# EasyEDA Pro project repeater.eprj

# Schematic Schematic1
Board Name: Board1; Create Date: 2026-04-16; Page Name: P1; Project Name: repeater; Schematic Name: Schematic1; Update Date: 2026-06-14; Company: EasyEDA.com; Page Size: A4; Version: V1.0
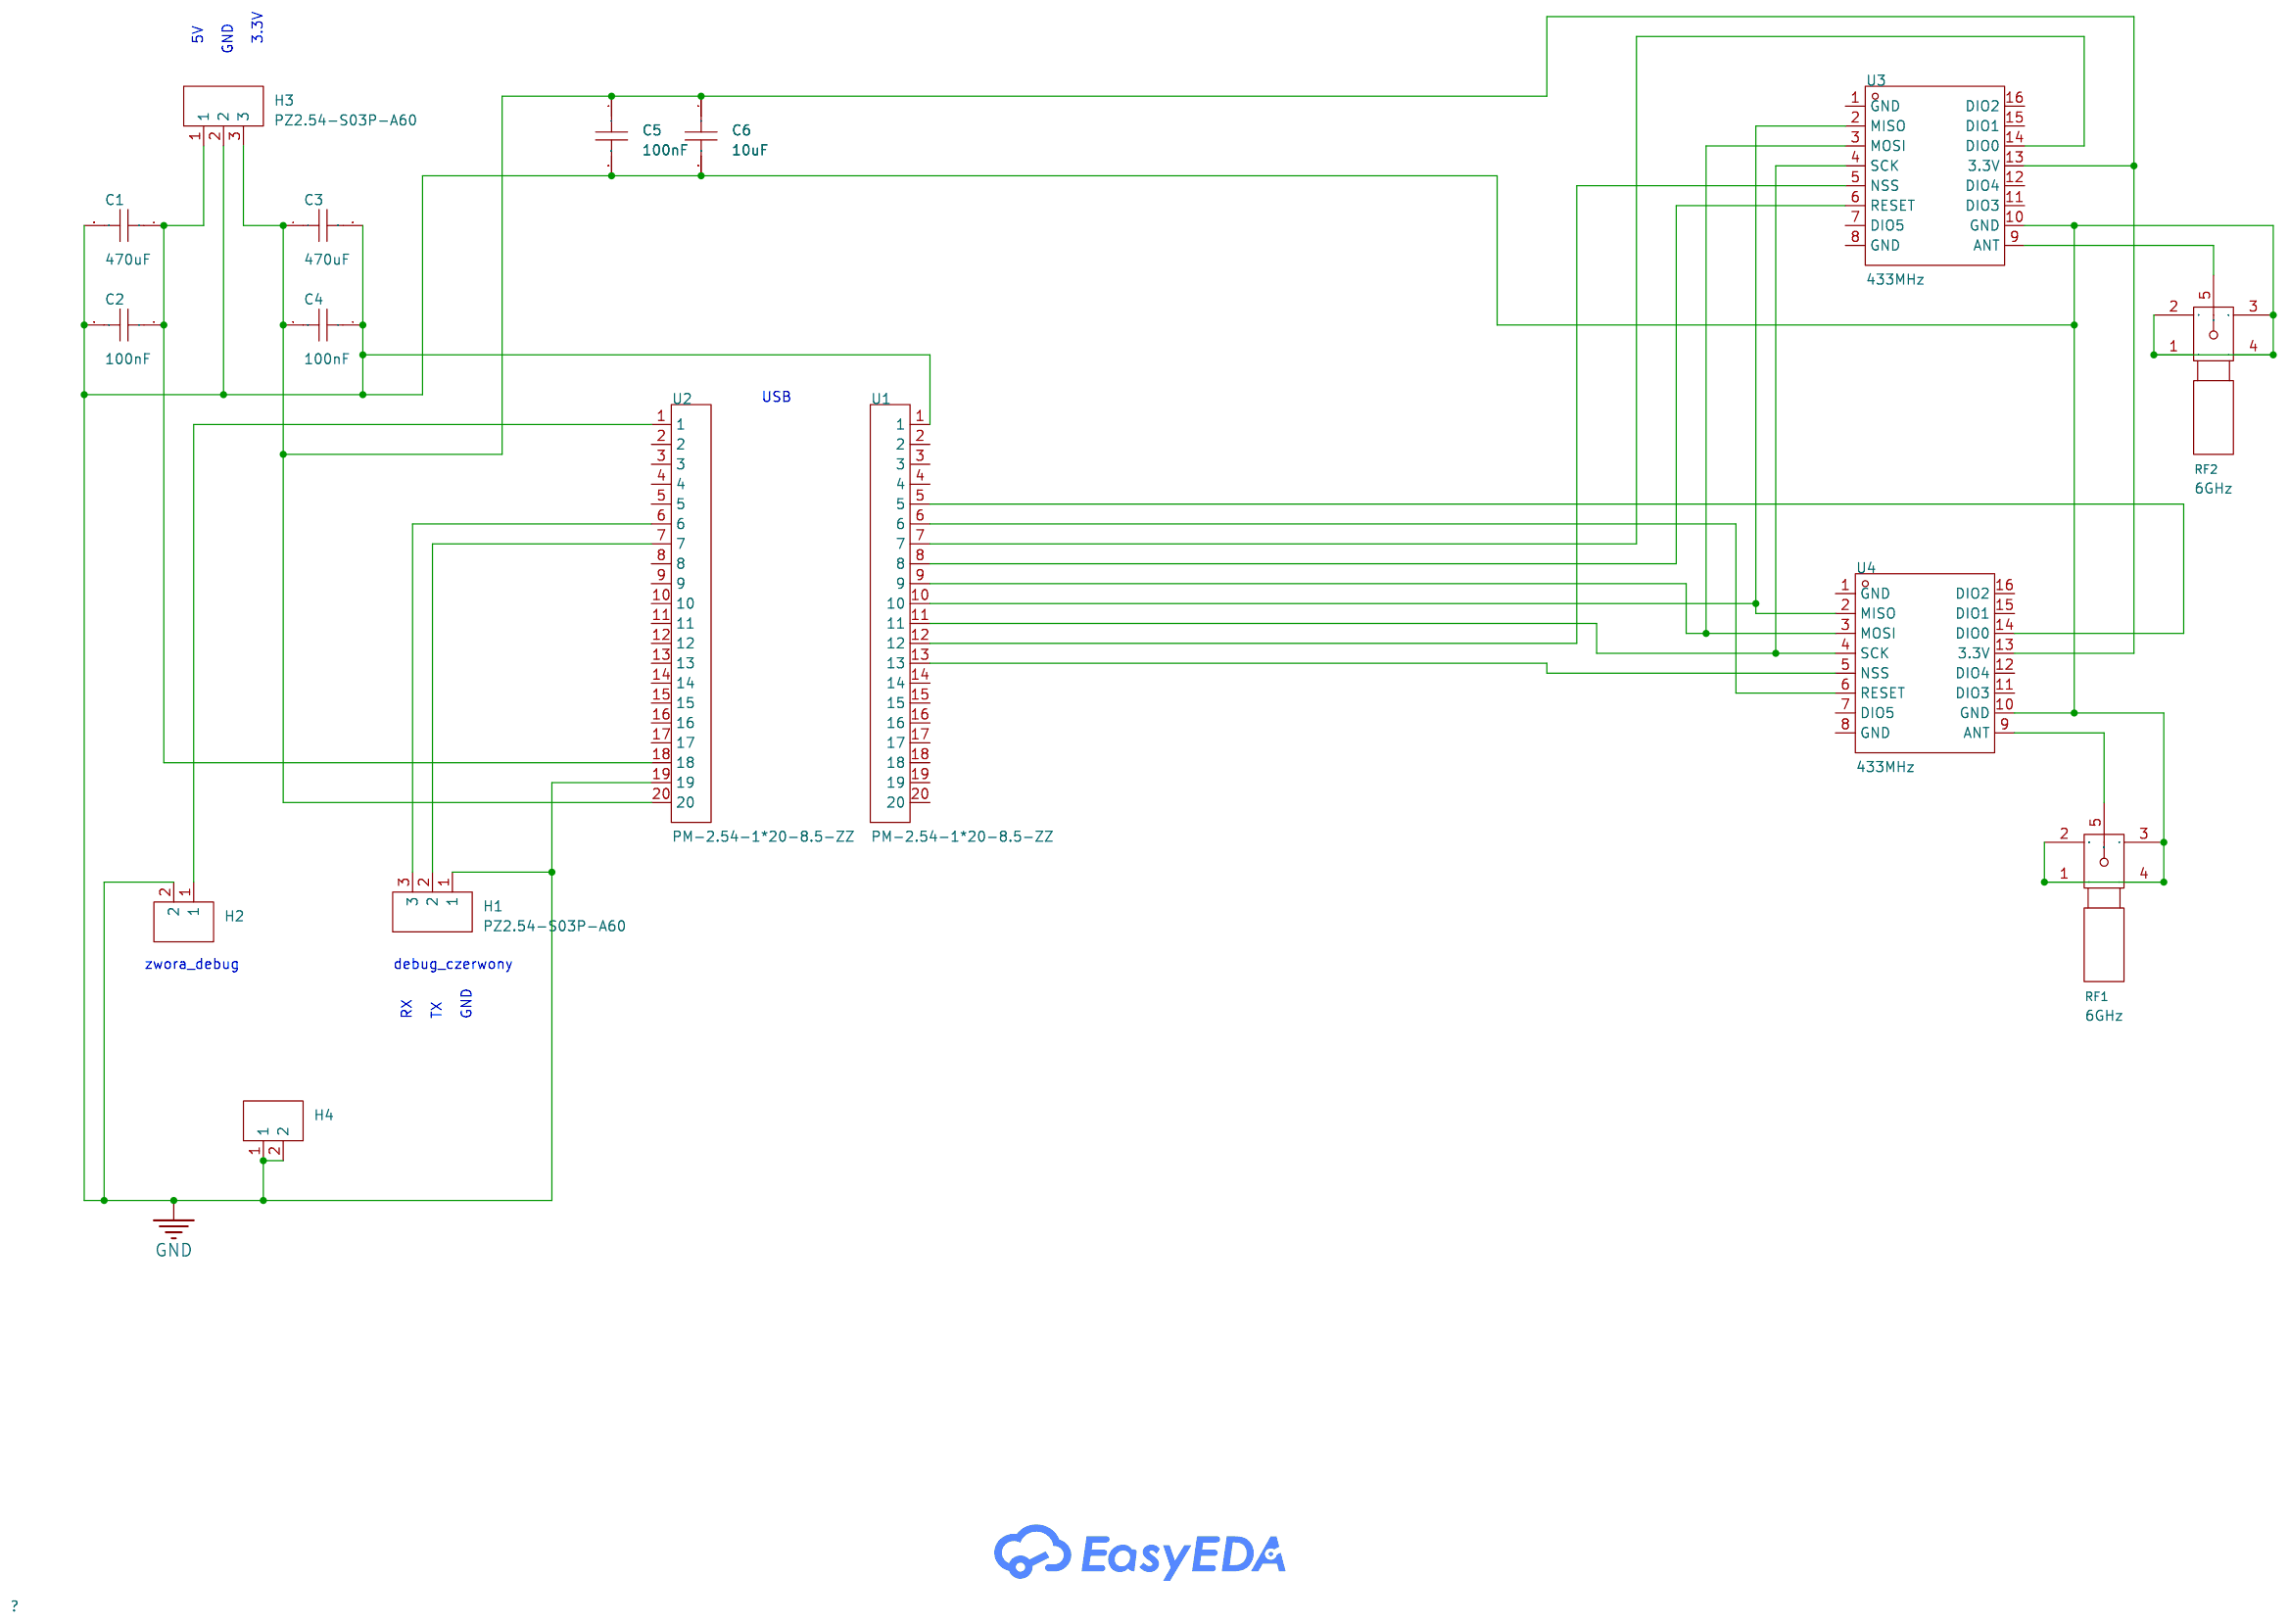
[diagram p0: schematic sheet]

## Parts
C1  470uF  [CAP-TH_BD10.0-P5.00-D0.6-FD]
C2  100nF  [C0603]
C3  470uF  [CAP-TH_BD10.0-P5.00-D0.6-FD]
C4  100nF  [C0603]
C5  100nF  [C0603]
C6  10uF  [C0603]
H1  PZ2.54-S03P-A60  [HDR-TH_3P-P2.54-V-M-B]
H2  PZ2.54-0102P-H25  [HDR-TH_2P-P2.54-V-M_2]
H3  PZ2.54-S03P-A60  [HDR-TH_3P-P2.54-V-M-B]
H4  PZ2.54-0102P-H25  [HDR-TH_2P-P2.54-V-M_2]
RF1  6GHz  [SMA-TH_BWSMA-KE-Z001]
RF2  6GHz  [SMA-TH_BWSMA-KE-Z001]
U1  PM-2.54-1*20-8.5-ZZ  [HDR-TH_20P-P2.54-V-F-2]
U2  PM-2.54-1*20-8.5-ZZ  [HDR-TH_20P-P2.54-V-F-2]
U3  433MHz  [COMM-SMD_RFM95W]
U4  433MHz  [COMM-SMD_RFM95W]

## Library data of the parts
C1 C3 = 470UF25VG130GF: LCSC Part Name: 470uF ±20% 25V; Supplier Part: C46867093; Manufacturer: Econd(米朗电子); Supplier Footprint: 插件,D10xL13mm; Datasheet: https://item.szlcsc.com/datasheet/470UF25VG130GF/49031958.html; Supplier: LCSC; Tolerance: ±20%; Voltage Rating: 25V; Ripple Current: 865mA@100KHz; Equivalent Series Resistance(ESR): 76mΩ; Pin Spacing: 5mm; Diameter: 10mm; Height - Seated (Max): 13mm; Lifetime: 3000hrs@105℃; Operating Temperature: -40℃~+105℃
C2 C4 C5 = CC0603KRX7R9BB104: Capacitance:100nF Tolerance:±10% Tolerance:±10% Voltage Rating:50V Temperature Coefficient:X7R; LCSC Part Name: 100nF ±10% 50V; Supplier Part: C14663; Manufacturer: YAGEO(国巨); Supplier Footprint: 0603; JLCPCB Part Class: Basic Part; Datasheet: https://item.szlcsc.com/datasheet/CC0603KRX7R9BB104/15331.html; Supplier: LCSC; Tolerance: ±10%; Voltage Rating: 50V; Temperature Coefficient: X7R
C6 = CL10A106KP8NNNC: Capacitance:10uF Tolerance:±10% Tolerance:±10% Voltage Rating:10V Temperature Coefficient:X5R; LCSC Part Name: 10uF ±10% 10V; Supplier Part: C19702; Manufacturer: SAMSUNG(三星); Supplier Footprint: 0603; JLCPCB Part Class: Basic Part; Datasheet: https://item.szlcsc.com/datasheet/CL10A106KP8NNNC/20411.html; Supplier: LCSC; Tolerance: ±10%; Voltage Rating: 10V; Temperature Coefficient: X5R
H1 H3 = PZ2.54-S03P-A60: LCSC Part Name: 1x3P 间距:2.54mm 方针 直插; Supplier Part: C42431831; Manufacturer: JXTCONN(聚兴泰); Supplier Footprint: 插件,P=2.54mm; JLCPCB Part Class: Extended Part; Datasheet: https://item.szlcsc.com/datasheet/PZ2.54-S03P-A60/44458961.html; Supplier: LCSC; Pin Structure: 1x3P; Pitch: 2.54mm; Circluar Pins/Square Pins: Pin Header; Mounting Type: Through Hole; Number of Rows: 1; Number of Pins: 3P; Current Rating: 3A; Length of Mating Pin: 6mm; Insulation Height: 2.5mm; Length of End Connection Pin: 3mm; Contact Material: Brass; Contact Plating: Gold; Operating Temperature: -40℃~+105℃; Color: Black
H2 H4 = PZ2.54-0102P-H25: LCSC Part Name: 1x2P 间距:2.54mm 方针 直插; Supplier Part: C42431819; Manufacturer: JXTCONN(聚兴泰); Supplier Footprint: 插件,P=2.54mm; JLCPCB Part Class: Extended Part; Datasheet: https://item.szlcsc.com/datasheet/PZ2.54-0102P-H25/44458949.html; Supplier: LCSC; Pin Structure: 1x2P; Pitch: 2.54mm; Circluar Pins/Square Pins: Pin Header; Mounting Type: Through Hole; Number of Rows: 1; Number of Pins: 2P; Current Rating: 3A; Length of Mating Pin: 6mm; Insulation Height: 2.5mm; Length of End Connection Pin: 3mm; Contact Material: Brass; Contact Plating: Gold; Operating Temperature: -40℃~+105℃; Color: Black
RF1 RF2 = BWSMA-KE-Z001_C496549: LCSC Part Name: 内孔 SMA 正脚; Supplier Part: C496549; Manufacturer: BAT WIRELESS(蝙蝠无线); Manufacturer Part: BWSMA-KE-Z001; Supplier Footprint: 插件; JLCPCB Part Class: Extended Part; Datasheet: https://item.szlcsc.com/datasheet/BWSMA-KE-Z001/508498.html; Supplier: LCSC; Connector Type: Board Side; Interface: Inner Bore; Number of Ports: 1; Interface Diameter: 6.2mm; RF Series: SMA; Impedance: 50Ω; Style: Positive Pin; Operating Temperature Range: -65℃~+165℃
U1 U2 = PM-2.54-1*20-8.5-ZZ: LCSC Part Name: 1x20P 间距:2.54mm 直插; Supplier Part: C53207428; Manufacturer: BXCONN(宝讯); Supplier Footprint: 插件,P=2.54mm; JLCPCB Part Class: Extended Part; Datasheet: https://item.szlcsc.com/datasheet/PM-2.54-1*20-8.5-ZZ/56243332.html; Supplier: LCSC; Holes Structure: 1x20P; Pitch: 2.54mm; Circular Hole / Square Hole: Square Hole; Mounting Type: Through Hole; Number of Rows: 1; Number of Positions: 20P; Current Rating: 3A; Holes Direction: Top; Insulation Height: 8.5mm; Contact Material: Brass; Contact Plating: Gold; Operating Temperature: -40℃~+105℃; PIN Length: 3.2mm
U3 U4 = DL-RFM96-433M: Frequency:433MHz Output Power:-1dBm~95dBm Output Power:-1dBm~95dBm Support Interface:SPI Modulation System:LoRa；MSK；GFSK；FSK；GMSK Operating Voltage:3.3V Operating Voltage:3.3V Antenna Type:- Receive  Current:10.8mA Send  Current:120mA Sensitivity:-148dBm; LCSC Part Name: lora模块 sx1276 433M无射频线模块 接收发射一体loraWAN超远距离; Supplier Part: C2844474; Manufacturer: DreamLNK(骏晔科技); Supplier Footprint: SMD,16x16mm; JLCPCB Part Class: Extended Part; Datasheet: https://atta.szlcsc.com/upload/public/pdf/source/20240412/4C032EDBEA51F5778F500F593BDA4CE8.pdf; Supplier: LCSC; Output Power: -1dBm~95dBm; Support Interface: SPI; Modulation System: LoRa；MSK；GFSK；FSK；GMSK; Operating Voltage: 3.3V; Receive  Current: 10.8mA; Send  Current: 120mA; Sensitivity: -148dBm; Operating Temperature: -20℃~+70℃

## Nets
GND: C1.2 C2.2 C3.2 C4.1 C5.2 C6.2 H1.1 H2.2 H3.2 H4.1 H4.2 RF1.1 RF1.2 RF1.3 RF1.4 RF2.1 RF2.2 RF2.3 RF2.4 U1.1 U2.19 U3.10(GND) U4.10(GND)
$1N962: H2.1 U2.1
$1N975: H1.3 U2.6
$1N980: H1.2 U2.7
$1N1152: C1.1 C2.1 H3.1 U2.18
$1N1262: C3.1 C4.2 C5.1 C6.1 H3.3 U2.20 U3.13(3.3V) U4.13(3.3V)
$1N1434: U1.5 U4.14(DIO0)
$1N1440: U1.6 U4.6(RESET)
$1N1447: U1.7 U3.14(DIO0)
$1N1459: U1.8 U3.6(RESET)
$1N1469: U1.9 U3.3(MOSI) U4.3(MOSI)
$1N1489: U1.10 U3.2(MISO) U4.2(MISO)
$1N1508: U1.11 U3.4(SCK) U4.4(SCK)
$1N1528: U1.12 U3.5(NSS)
$1N1535: U1.13 U4.5(NSS)
$1N1993: RF2.5 U3.9(ANT)
$1N1998: RF1.5 U4.9(ANT)

Not connected (* = marked no-connect by the designer): U1 2 3 4 14 15 16 17 18 19 20; U2 2 3 4 5 8 9 10 11 12 13 14 15 16 17; U3 1(GND) 7(DIO5) 8(GND) 11(DIO3) 12(DIO4) 15(DIO1) 16(DIO2); U4 1(GND) 7(DIO5) 8(GND) 11(DIO3) 12(DIO4) 15(DIO1) 16(DIO2)

## Notes on the sheet
- 5V
- 3.3V
- GND
- USB
- zwora_debug
- debug_czerwony
- RX
- TX
- GND

# Board PCB1
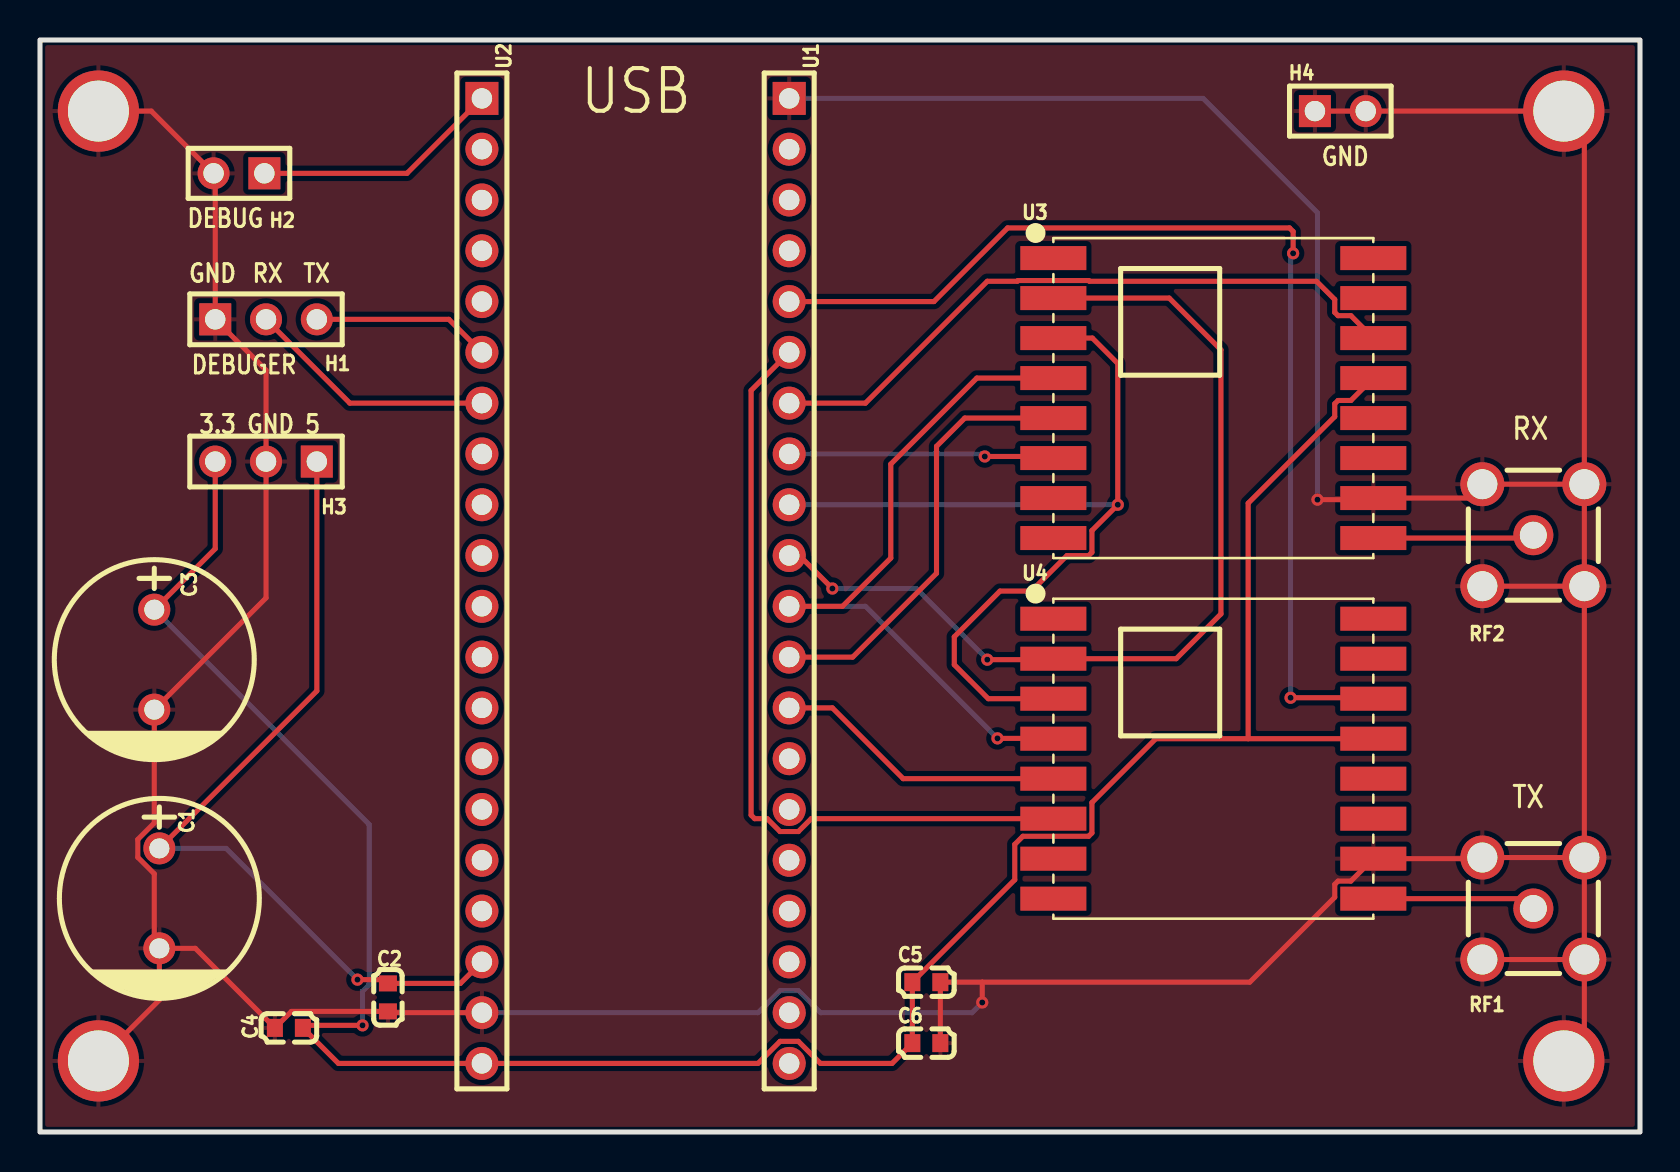
[diagram p1: board, top side]
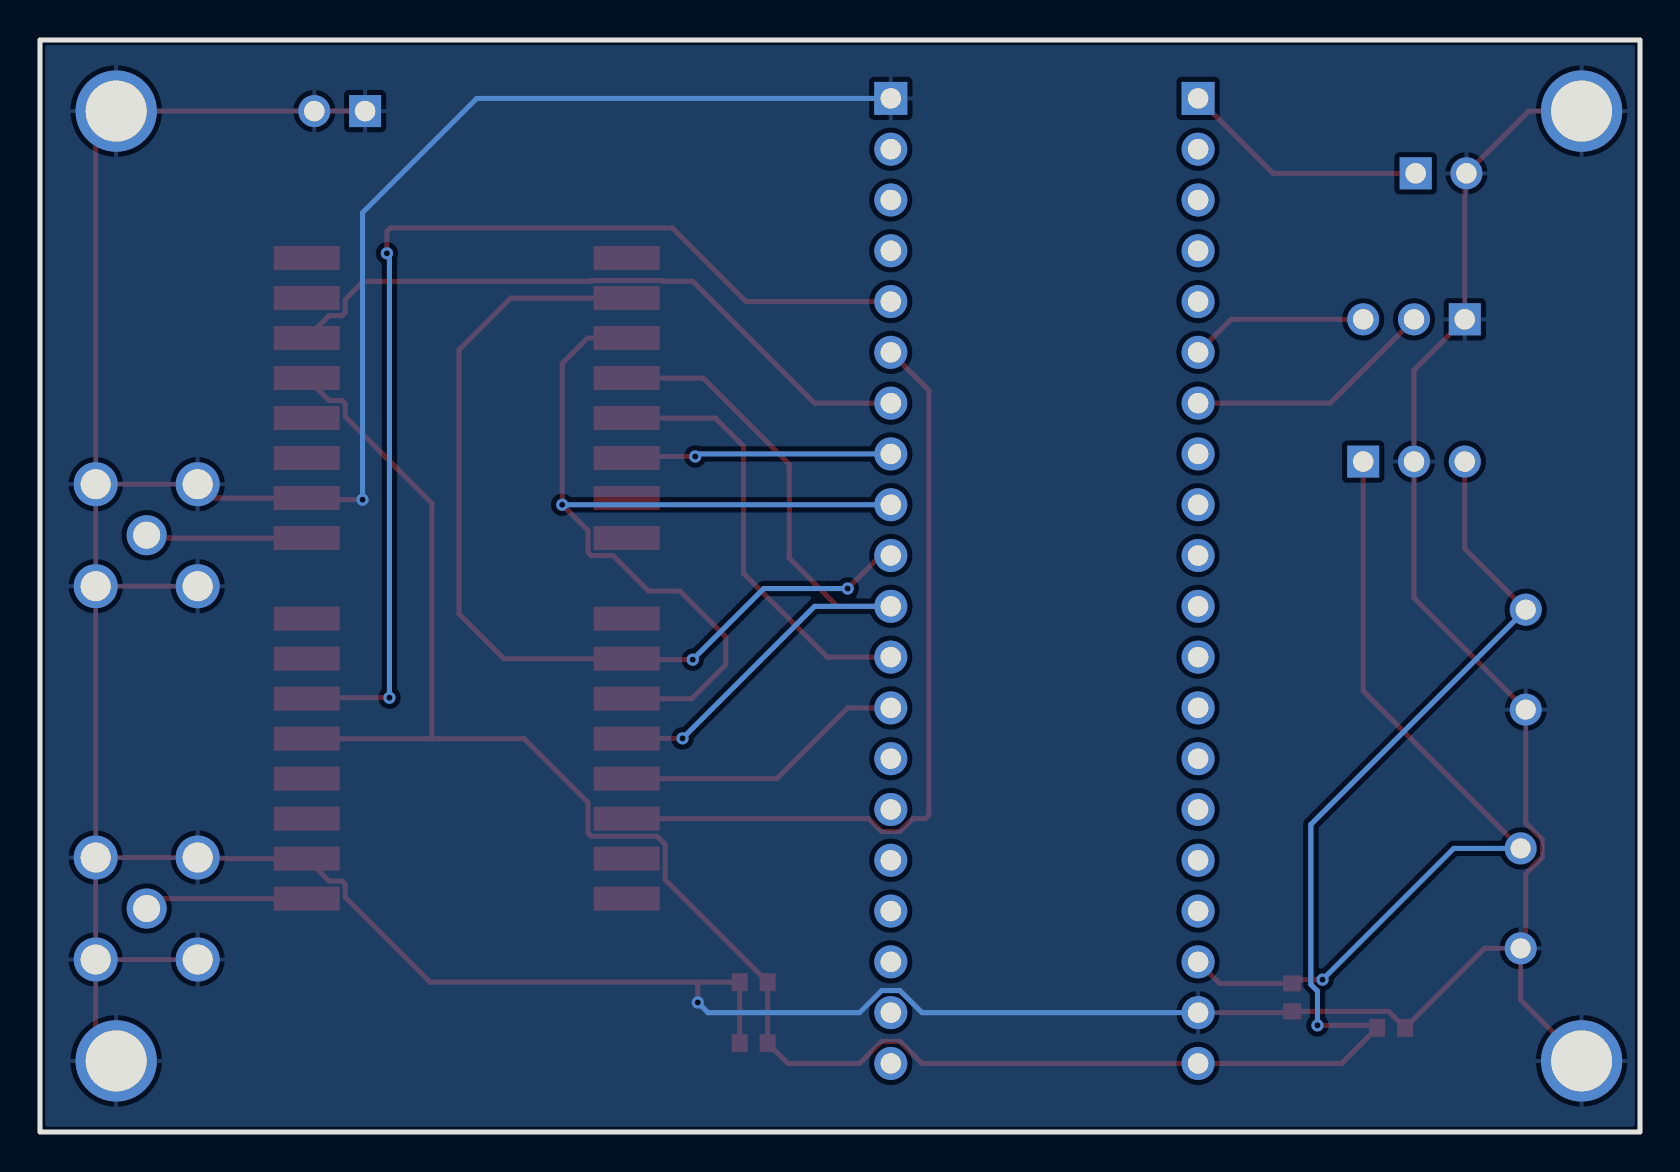
[diagram p2: board, bottom side, seen from below]

Outline 80.01 x 54.61 mm; copper layers: Top Layer, Bottom Layer. Coordinates in mm from the lower left corner of the outline.
Outline path: rectangle 0,54.61 80.01,0
Stack: Top Layer 0.035mm / Dielectric1 1.51mm FR4 er 4.5 / Bottom Layer 0.035mm

## Design rules (mm)
template: JLCPCB Capability(Two Layers Board)
spacing copperThickness1oz (default): track to track 0.102, other pairs 0.152 to 0.3
spacing copperThickness2oz: track to track 0.203, other pairs 0.152 to 0.3
track width copperThickness1oz (default): min 0.127, default 0.254, max 2.54
track width copperThickness2oz: min 0.203, default 0.254, max 2.54
differential pair differentialPair (default): width min 0.127, default 0.254, max 2.54; gap min 0.152, default 0.152
via viaSize (default): diameter min 0.5, default 0.61, max 10; hole min 0.3, default 0.305, max 6.3

## Placement (name value [footprint] x y rotation side)
C1  470uF  [CAP-TH_BD10.0-P5.00-D0.6-FD]  5.97 11.68 270 top
C2  100nF  [C0603]  17.4 6.73 270 top
C3  470uF  [CAP-TH_BD10.0-P5.00-D0.6-FD]  5.72 23.62 270 top
C4  100nF  [C0603]  12.45 5.21 0 top
C5  100nF  [C0603]  44.32 7.49 0 top
C6  10uF  [C0603]  44.32 4.45 0 top
H1  PZ2.54-S03P-A60  [HDR-TH_3P-P2.54-V-M-B]  11.3 40.64 180 top
H2  PZ2.54-0102P-H25  [HDR-TH_2P-P2.54-V-M_2]  9.95 47.94 180 top
H3  PZ2.54-S03P-A60  [HDR-TH_3P-P2.54-V-M-B]  11.3 33.53 0 top
H4  PZ2.54-0102P-H25  [HDR-TH_2P-P2.54-V-M_2]  65.02 51.05 0 top
NOREF  -  [Pad_e305]  76.2 51.05 0 top
NOREF#2  -  [Pad_e304]  76.2 3.56 0 top
NOREF#3  -  [Pad_e301]  2.92 51.05 0 top
NOREF#4  -  [Pad_e303]  2.92 3.56 0 top
RF1  6GHz  [SMA-TH_BWSMA-KE-Z001]  74.68 11.18 0 top
RF2  6GHz  [SMA-TH_BWSMA-KE-Z001]  74.68 29.85 90 top
U1  PM-2.54-1*20-8.5-ZZ  [HDR-TH_20P-P2.54-V-F-2]  37.47 27.56 270 top
U2  PM-2.54-1*20-8.5-ZZ  [HDR-TH_20P-P2.54-V-F-2]  22.1 27.56 270 top
U3  433MHz  [COMM-SMD_RFM95W]  58.67 36.7 0 top
U4  433MHz  [COMM-SMD_RFM95W]  58.67 18.67 0 top

## Footprints (pads in the part's own frame, mm; a bottom-side part is the same pattern mirrored in y, then rotated)
C0603
  rect 0.8x0.9 smd: 1(-0.7,0) 2(0.7,0)
CAP-TH_BD10.0-P5.00-D0.6-FD
  round 1.6 hole 1: 1(-2.5,0) 2(2.5,0)
COMM-SMD_RFM95W
  rect 3.3x1.2 smd: 1(-8,7) 2(-8,5) 3(-8,3) 4(-8,1) 5(-8,-1) 6(-8,-3) 7(-8,-5) 8(-8,-7) 9(8,-7) 10(8,-5) 11(8,-3) 12(8,-1) 13(8,1) 14(8,3) 15(8,5) 16(8,7)
HDR-TH_2P-P2.54-V-M_2
  rect 1.6x1.6 hole 1.02: 1(-1.27,0)
  round 1.6 hole 1.02: 2(1.27,0)
HDR-TH_3P-P2.54-V-M-B
  rect 1.6x1.6 hole 1.02: 1(2.54,0)
  round 1.6 hole 1.02: 2(0,0) 3(-2.54,0)
HDR-TH_20P-P2.54-V-F-2
  rect 1.65x1.65 hole 1.02: 1(-24.13,0)
  round 1.65 hole 1.02: 2(-21.59,0) 3(-19.05,0) 4(-16.51,0) 5(-13.97,0) 6(-11.43,0) 7(-8.89,0) 8(-6.35,0) 9(-3.81,0) 10(-1.27,0) 11(1.27,0) 12(3.81,0) 13(6.35,0) 14(8.89,0) 15(11.43,0) 16(13.97,0) 17(16.51,0) 18(19.05,0) 19(21.59,0) 20(24.13,0)
Pad_e301
  round 4.064 hole 3.048: 1(0,0)
Pad_e303
  round 4.064 hole 3.048: 1(0,0)
Pad_e304
  round 4.064 hole 3.048: 1(0,0)
Pad_e305
  round 4.064 hole 3.048: 1(0,0)
SMA-TH_BWSMA-KE-Z001
  round 2.2 hole 1.5: 1(-2.55,-2.55) 2(-2.55,2.55) 3(2.55,2.55) 4(2.55,-2.55)
  round 2 hole 1.35: 5(0,0)

## Nets
As in the schematic, except:
GND: C1.2 C2.2 C3.2 C4.1 C5.2 C6.2 H1.1 H2.2 H3.2 H4.1 H4.2 NOREF.1 NOREF#2.1 NOREF#3.1 NOREF#4.1 RF1.1 RF1.2 RF1.3 RF1.4 RF2.1 RF2.2 RF2.3 RF2.4 U1.1 U2.19 U3.10 U4.10

Pads without a net: U1 2 3 4 14 15 16 17 18 19 20; U2 2 3 4 5 8 9 10 11 12 13 14 15 16 17; U3 1 7 8 11 12 15 16; U4 1 7 8 11 12 15 16

## Via types
v1: diameter 0.61, hole 0.305, Top Layer to Bottom Layer, 11 vias

## Routing (per net, layer and track width the routed paths; a pad name or vN(x,y) marks a point on that pad's centre or on a via; arc(x,y) is an arc through that point)
GND: length 268.2
  Top Layer w0.254: RF1.3 RF1.2 72.07,13.67 U4.10 65.55,12.55 64.91,12.55 64.75,12.38 64.75,11.74 60.5,7.49 47.12,7.49 ; RF1.3 RF2.1 ; RF1.3 RF1.4 ; RF2.4 RF2.3 71.43,31.7 U3.10 66.59,31.62 v1(63.88,31.62) ; RF2.4 RF2.1 ; RF2.4 77.23,50.03 NOREF.1 H4.2 H4.1 ; RF2.1 RF2.2 ; 47.12,7.49 47.12,7.49 v1(47.12,6.48) ; 47.12,7.49 C5.2 C6.2 ; C1.2 5.72,9.44 5.72,12.91 4.89,13.74 4.89,14.63 5.72,15.46 C3.2 11.3,26.71 H3.2 11.3,38.1 8.76,40.64 8.76,47.86 H2.2 5.57,51.05 NOREF#3.1 ; C1.2 5.97,6.6 NOREF#4.1 ; C1.2 7.77,9.18 C4.1 12.57,6.03 C2.2 17.46,5.97 U2.19 ; NOREF#2.1 77.23,4.58 RF1.4 ; RF1.4 RF1.1
  Bottom Layer w0.254: v1(63.88,31.62) 63.88,45.97 58.17,51.69 U1.1 ; U2.19 35.9,5.97 37.01,7.07 37.92,7.07 39.03,5.97 46.61,5.97 v1(47.12,6.48)
$1N962: length 12.4
  Top Layer w0.254: U2.1 18.35,47.94 H2.1
$1N975: length 8.9
  Top Layer w0.254: 22.1,38.99 20.45,40.64 H1.3
$1N980: length 12.5
  Top Layer w0.254: U2.7 15.49,36.45 H1.2
$1N1152: length 42
  Top Layer w0.254: U2.18 21.02,7.43 C2.1 17.21,7.62 v1(15.88,7.62) ; C1.1 13.84,22.06 H3.1
  Bottom Layer w0.254: v1(15.88,7.62) 9.31,14.18 C1.1
$1N1262: length 123.7
  Top Layer w0.254: 60.42,19.67 55.8,19.67 52.6,16.47 52.6,14.95 52.44,14.79 49.15,14.79 48.75,14.38 48.75,12.62 C5.1 C6.1 42.61,3.43 39.03,3.43 37.92,4.53 37.01,4.53 35.9,3.43 U2.20 14.92,3.43 C4.2 13.27,5.33 v1(16.13,5.33) ; 60.42,19.67 60.42,31.45 64.75,35.77 64.75,36.42 64.91,36.58 65.55,36.58 U3.13 ; 60.42,19.67 U4.13 ; 8.76,33.53 8.76,29.17 C3.1
  Bottom Layer w0.254: C3.1 16.46,15.38 16.46,7.38 16.13,7.05 v1(16.13,5.33)
$1N1434: length 54.3
  Top Layer w0.254: v1(62.54,21.72) 66.63,21.72 U4.14 ; v1(62.66,43.94) 62.66,45.03 62.48,45.21 48.39,45.21 44.7,41.53 U1.5
  Bottom Layer w0.254: v1(62.66,43.94) 62.54,43.82 v1(62.54,21.72)
$1N1440: length 39.7
  Top Layer w0.254: 37.47,38.99 35.56,37.08 35.56,15.85 35.74,15.67 36.36,15.67 37.01,15.03 37.92,15.03 38.57,15.67 U4.6
$1N1447: length 33.3
  Top Layer w0.254: U1.7 41.28,36.45 47.37,42.55 48.87,42.55 48.91,42.58 52.44,42.58 52.48,42.55 63.83,42.55 64.75,41.63 64.75,40.99 64.91,40.82 65.55,40.82 U3.14
$1N1459: length 13.3
  Top Layer w0.254: v1(47.24,33.78) 50.59,33.78 U3.6
  Bottom Layer w0.254: v1(47.24,33.78) 47.12,33.91 37.47,33.91
$1N1469: length 45.8
  Top Layer w0.254: U4.3 47.42,21.67 45.72,23.37 45.72,24.77 48.01,27.05 49.58,27.05 51.35,28.82 52.44,28.82 52.6,28.99 52.6,30.08 v1(53.9,31.37) 53.9,38.43 52.63,39.7 U3.3
  Bottom Layer w0.254: U1.9 v1(53.9,31.37)
$1N1489: length 47.4
  Top Layer w0.254: U1.10 37.97,28.83 v1(39.62,27.18) ; U3.2 56.47,41.7 59.06,39.12 59.06,25.91 56.82,23.67 U4.2 50.63,23.62 v1(47.37,23.62)
  Bottom Layer w0.254: v1(39.62,27.18) 43.81,27.18 v1(47.37,23.62)
$1N1508: length 36.6
  Top Layer w0.254: v1(47.88,19.69) 50.66,19.69 U4.4 ; U3.4 46.85,37.7 42.54,33.4 42.54,28.7 40.13,26.29 U1.11
  Bottom Layer w0.254: U1.11 41.28,26.29 v1(47.88,19.69)
$1N1528: length 21.9
  Top Layer w0.254: U3.5 46.24,35.7 44.83,34.29 44.83,27.94 40.64,23.75 U1.12
$1N1535: length 14.7
  Top Layer w0.254: U1.13 39.62,21.21 43.16,17.67 U4.5
$1N1993: length 8.1
  Top Layer w0.254: U3.9 74.53,29.7 RF2.5
$1N1998: length 8.2
  Top Layer w0.254: RF1.5 74.18,11.67 U4.9

## Copper pours and planes (outline as drawn; the poured copper is in the pictures)
GND on Top Layer: 0,54.61 80.01,54.61 80.01,0 0,0
GND on Bottom Layer: 0,54.61 80.01,54.61 80.01,0 0,0

## Text on the board
Top Silkscreen Layer: DEBUG | 3.3 GND 5 | GND | DEBUGER | RX | TX | USB
